# EAGLE design mtorshield (EAGLE 7.5.0)
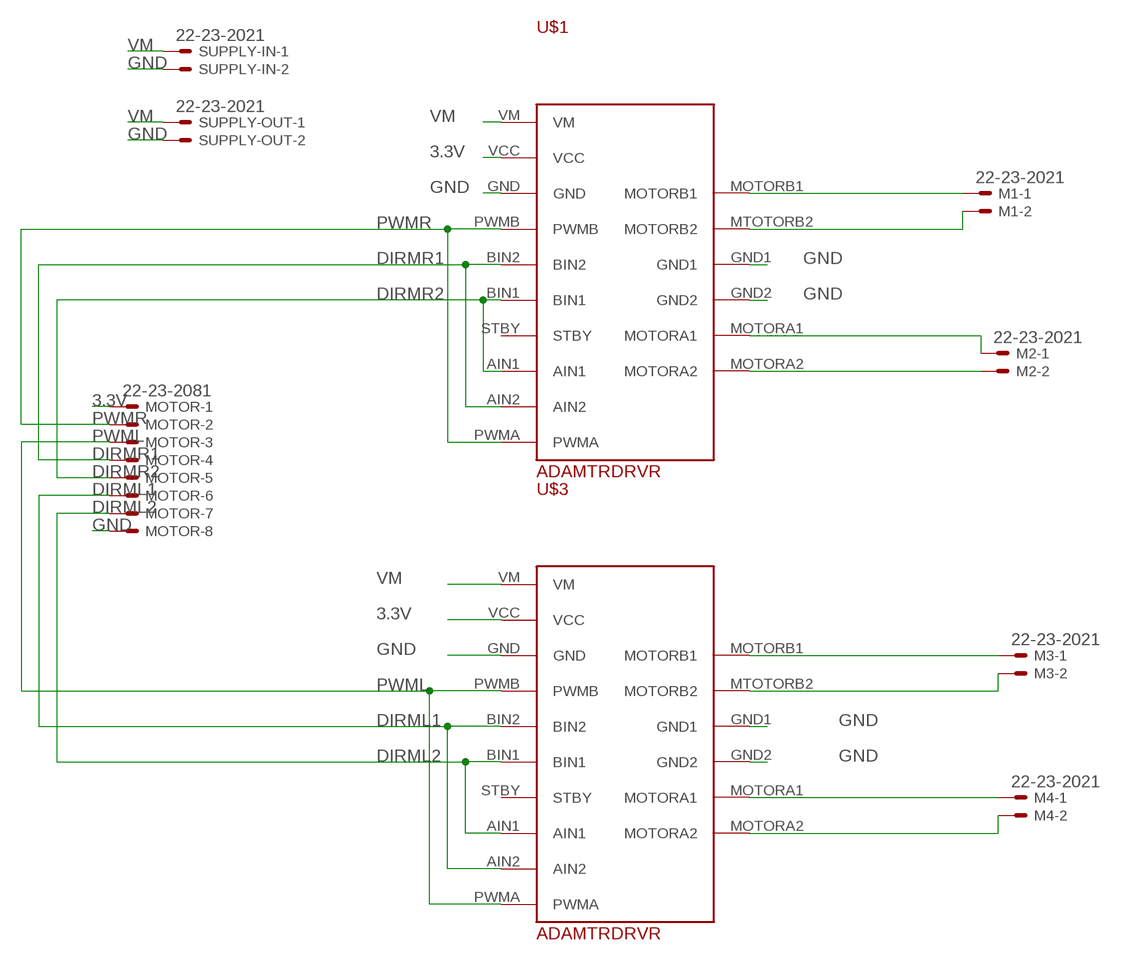
[diagram p0: schematic, sheet 1]

## Parts
M1  22-23-2021  [22-23-2021]
M2  22-23-2021  [22-23-2021]
M3  22-23-2021  [22-23-2021]
M4  22-23-2021  [22-23-2021]
MOTOR  22-23-2081  [22-23-2081]
SUPPLY-IN  22-23-2021  [22-23-2021]
SUPPLY-OUT  22-23-2021  [22-23-2021]
U$1  ADAMTRDRVR  [ADAMTRDRVR]
U$3  ADAMTRDRVR  [ADAMTRDRVR]

## Nets
3.3V: MOTOR.1 U$1.VCC U$3.VCC
DIRML1: MOTOR.6 U$3.AIN2 U$3.BIN2
DIRML2: MOTOR.7 U$3.AIN1 U$3.BIN1
DIRMR1: MOTOR.4 U$1.AIN2 U$1.BIN2
DIRMR2: MOTOR.5 U$1.AIN1 U$1.BIN1
GND: MOTOR.8 SUPPLY-IN.2 SUPPLY-OUT.2 U$1.GND U$1.GND1 U$1.GND2 U$3.GND U$3.GND1 U$3.GND2
N$1: M1.1 U$1.MOTORB1
N$2: M1.2 U$1.MTOTORB2(MOTORB2)
N$3: M2.1 U$1.MOTORA1
N$4: M2.2 U$1.MOTORA2
N$5: M3.1 U$3.MOTORB1
N$6: M3.2 U$3.MTOTORB2(MOTORB2)
N$7: M4.1 U$3.MOTORA1
N$8: M4.2 U$3.MOTORA2
PWML: MOTOR.3 U$3.PWMA U$3.PWMB
PWMR: MOTOR.2 U$1.PWMA U$1.PWMB
VM: SUPPLY-IN.1 SUPPLY-OUT.1 U$1.VM U$3.VM
Unconnected: U$1.STBY U$3.STBY

## Library data of the parts
M1-M4 SUPPLY-IN SUPPLY-OUT = con-molex:22-23-2021: .100" (2.54mm) Center Header - 2 Pin; MF: MOLEX; MPN: 22-23-2021; OC_FARNELL: 1462926; OC_NEWARK: 25C3832
MOTOR = con-molex:22-23-2081: .100" (2.54mm) Center Header - 8 Pin; MF: MOLEX; MPN: 22-23-2081; OC_FARNELL: 1756826; OC_NEWARK: 01C7592
U$1 U$3 = Adafruitmotordriver:ADAMTRDRVR

## Board
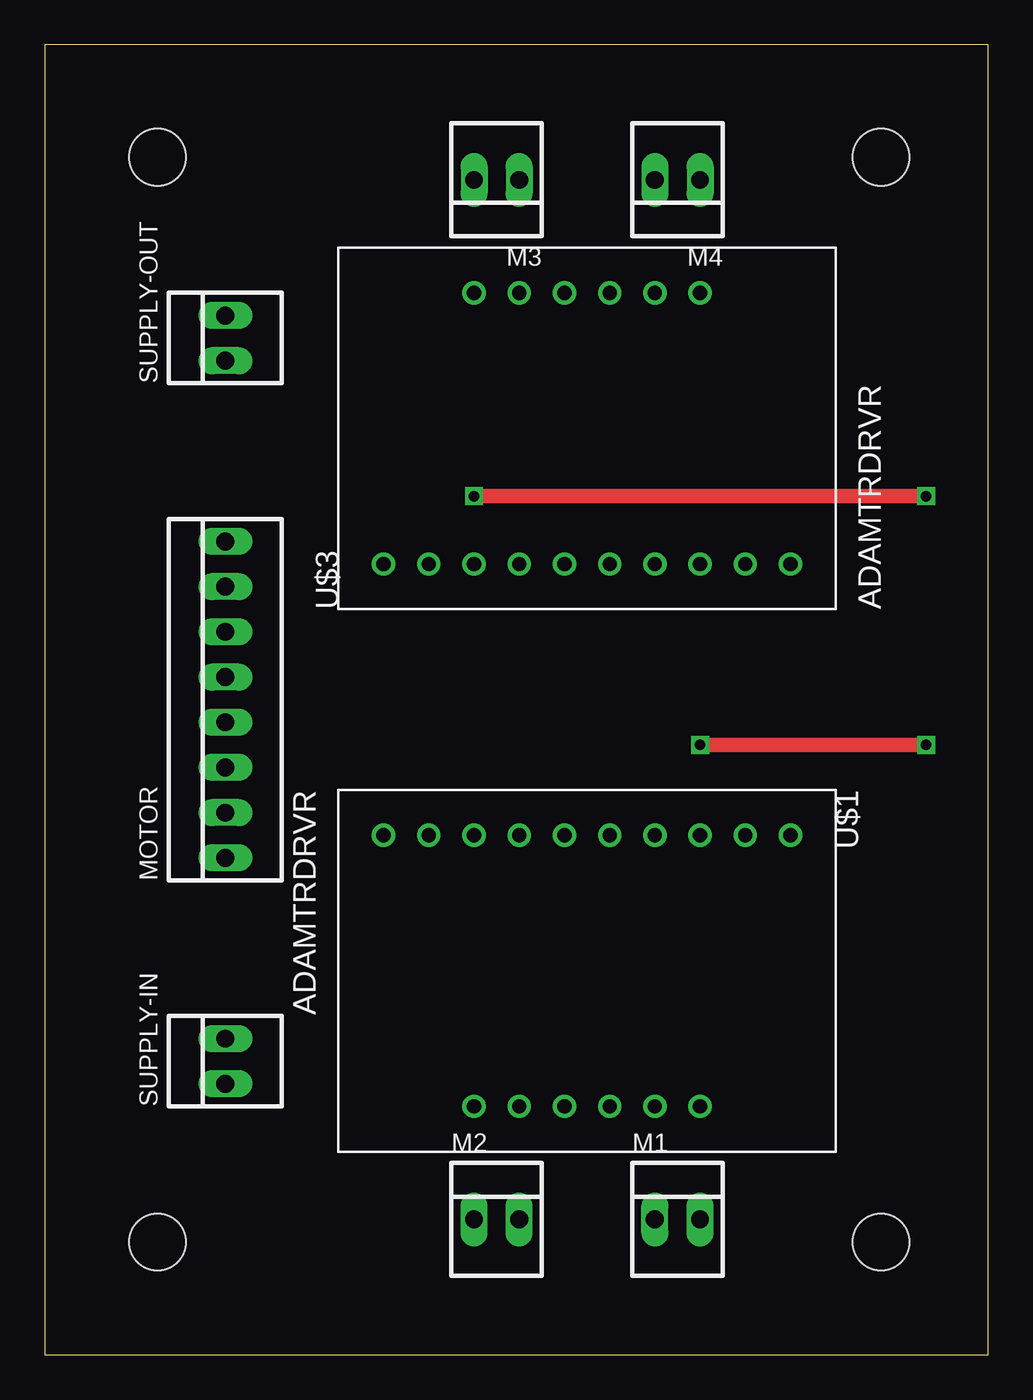
[diagram p1: board, top side]
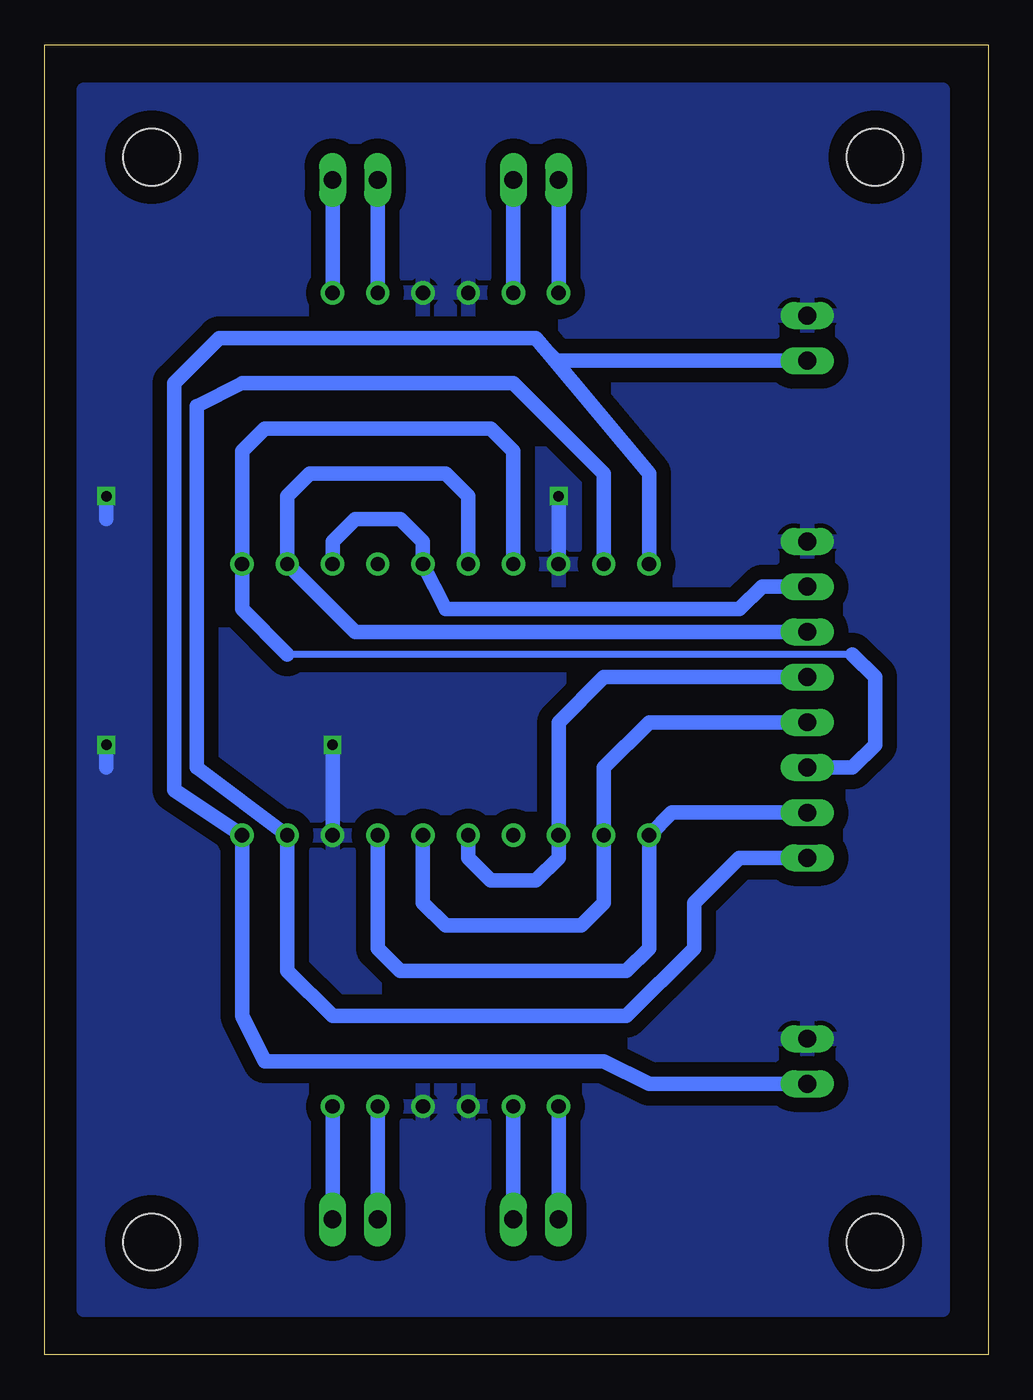
[diagram p2: board, bottom side, seen from below]

Size 53.01 x 73.65 mm. Coordinates in mm from the lower left corner, seen from the top.
Outline: 0,0 53.01,0 53.01,73.65 0,73.65 0,0
Copper layers (1*16): Top 0.035mm / dielectric 1.5mm / Bottom 0.035mm
Design rules "default": minimum track width 10mil, minimum drill 24mil, track to track 8mil, track to pad 8mil, pad to pad 8mil, via to via 8mil, smd to smd 8mil, copper to edge 40mil, drill to drill 8mil, minimum pad ring 10mil, minimum via ring 8mil, stop-mask expansion 4mil, vias tented up to drill 0mil, thermal gap 10mil
Holes 3.2 mm at 46.99,6.35 46.99,67.31 6.35,67.31 6.35,6.35

### Footprints (pad centres in the part's own frame; a part is rotated, then mirrored left to right if it is on the bottom)
22-23-2021 = drill 1 long: 1 -1.27,0; 2 1.27,0
22-23-2081 = drill 1 long: 1 -8.89,0; 2 -6.35,0; 3 -3.81,0; 4 -1.27,0; 5 1.27,0; 6 3.81,0; 7 6.35,0; 8 8.89,0
ADAMTRDRVR = drill 0.8: AIN1 2.54,7.62; AIN2 2.54,5.08; BIN1 2.54,12.7; BIN2 2.54,15.24; GND 2.54,20.32; GND1 17.78,12.7; GND2 17.78,15.24; MOTORA1 17.78,7.62; MOTORA2 17.78,10.16; MOTORB1 17.78,17.78; MTOTORB2 17.78,20.32; PWMA 2.54,2.54; PWMB 2.54,17.78; STBY 2.54,10.16; VCC 2.54,22.86; VM 2.54,25.4

### Placement (x,y rotation side)
M1  35.56,7.62 0 top
M2  25.4,7.62 0 top
M3  25.4,66.04 180 top
M4  35.56,66.04 180 top
MOTOR  10.16,36.83 90 top
SUPPLY-IN  10.16,16.51 90 top
SUPPLY-OUT  10.16,57.15 90 top
U$1  16.51,31.75 270 top
U$3  44.45,41.91 90 top

### Tracks (layer width: path | path; a pad name or v marks a point on that pad's centre or on a via)
3.3V
  Bottom 0.813: MOTOR.1 13.97,27.94 16.51,25.4 16.51,22.86 20.32,19.05 36.83,19.05 39.37,21.59 U$1.VCC 44.45,33.02 44.45,53.34 41.91,54.61 26.67,54.61 21.59,49.53 U$3.VCC
DIRML1
  Bottom 0.813: U$3.BIN2 29.21,48.26 30.48,49.53 38.1,49.53 39.37,48.26 U$3.AIN2 35.56,40.64 MOTOR.6
DIRML2
  Bottom 0.813: U$3.AIN1 36.83,45.72 35.56,46.99 33.02,46.99 31.75,45.72 U$3.BIN1 30.48,41.91 13.97,41.91 12.7,43.18 MOTOR.7
DIRMR1
  Bottom 0.813: U$1.BIN2 31.75,25.4 30.48,24.13 22.86,24.13 21.59,25.4 U$1.AIN2 21.59,33.02 19.05,35.56 MOTOR.4
DIRMR2
  Bottom 0.813: U$1.BIN1 29.21,27.94 27.94,26.67 25.4,26.67 24.13,27.94 U$1.AIN1 24.13,35.56 21.59,38.1 MOTOR.5
GND  (via drill 0.6)
  Top 0.813: v36.83,34.29 v49.53,34.29 | v24.13,48.26 v49.53,48.26
  Bottom 0.813: U$1.GND v36.83,34.29 | v49.53,34.29 49.53,33.02 | U$3.GND v24.13,48.26 | v49.53,48.26 49.53,46.99
  pour Bottom (isolate 0.813): 2.54,2.54 50.8,2.54 50.8,71.12 2.54,71.12
N$1
  Bottom 0.813: U$1.MOTORB1 M1.1
N$2
  Bottom 0.813: U$1.MTOTORB2 M1.2
N$3
  Bottom 0.813: U$1.MOTORA1 M2.1
N$4
  Bottom 0.813: U$1.MOTORA2 M2.2
N$5
  Bottom 0.813: M3.1 U$3.MOTORB1
N$6
  Bottom 0.813: M3.2 U$3.MTOTORB2
N$7
  Bottom 0.813: M4.1 U$3.MOTORA1
N$8
  Bottom 0.813: M4.2 U$3.MOTORA2
PWML
  Bottom 0.406: 7.62,39.37 39.37,39.37
  Bottom 0.813: U$3.PWMB 26.67,50.8 27.94,52.07 40.64,52.07 41.91,50.8 U$3.PWMA 41.91,41.91 39.37,39.37 | MOTOR.3 7.62,33.02 6.35,34.29 6.35,38.1 7.62,39.37
PWMR
  Bottom 0.813: U$1.PWMB 34.29,22.86 33.02,21.59 20.32,21.59 19.05,22.86 U$1.PWMA 17.78,30.48 MOTOR.2
VM
  Bottom 0.813: SUPPLY-IN.1 19.05,15.24 21.59,16.51 40.64,16.51 41.91,19.05 U$1.VM 45.72,31.75 45.72,54.61 43.18,57.15 25.4,57.15 24.78,56.4 | U$3.VM 19.05,49.53 24.78,56.4 | SUPPLY-OUT.1 24.25,55.88 24.78,56.4